# EAGLE design TPS22917 Breakout (EAGLE 9.5.2)
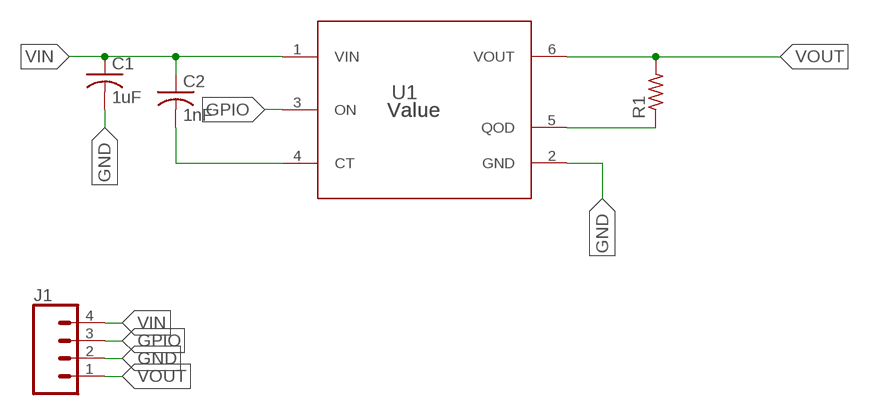
[diagram p0: schematic, sheet 1]

## Parts
C1  1uF  C-USC0603  [C0603]
C2  1nF  C-USC0603  [C0603]
J1  CONN_041X04_NO_SILK  [1X04_NO_SILK]
R1  R-US_R0603  [R0603]
U1  Value  TPS22917DBVRDBV0006_L  [DBV0006_L]

## Nets
GND: C1.2 J1.2 U1.2(GND)
GPIO: J1.3 U1.3(ON)
N$2: C2.2 U1.4(CT)
N$5: R1.1 U1.5(QOD)
VIN: C1.1 C2.1 J1.4 U1.1(VIN)
VOUT: J1.1 R1.2 U1.6(VOUT)

## Library data of the parts
C1 C2 = rcl:C-US: CAPACITOR, American symbol; SPICEPREFIX: C
J1 = SparkFun-Connectors:CONN_04: Multi connection point. Often used as Generic Header-pin footprint for 0.1 inch spaced/style header connections On any of the 0.1 inch spaced packages, you can populate with these: Break Away Headers - Straight <https://www.sparkfun.com/products/116> (PRT-00116) Break Away Male Headers - Right Angle <https://www.sparkfun.com/products/553> (PRT-00553) Female Headers <https://www.sparkfun.com/products/115> (PRT-00115) Break Away Headers - Machine Pin <https://www.sparkfun.com/products/117> (PRT-00117) Break Away Female Headers - Swiss Machine Pin <https://www.sparkfun.com/products/743> (PRT-00743) For SCREWTERMINALS and SPRING TERMINALS visit here: Screw Terimnals on SparkFun.com <https://www.sparkfun.com/search/results?term=Screw+Terminals> (5mm/3.5mm/2.54mm spacing) This device is also useful as a general connection point to wire up your design to another part of your project. Our various solder wires solder well into these plated through hole pads. Hook-Up Wire - Assortment (Stranded, 22 AWG) <https://www.sparkfun.com/products/11375> (PRT-11375) Hook-Up Wire - Assortment (Solid Core, 22 AWG) <https://www.sparkfun.com/products/11367> (PRT-11367) View the entire wire category on our website here <https://www.sparkfun.com/categories/141> Special notes: Molex polarized connector foot print use with SKU : PRT-08231 with associated crimp pins and housings. 1MM SMD Version SKU: PRT-10208; PROD_ID: CONN-09696
R1 = rcl:R-US_: RESISTOR, American symbol; SPICEPREFIX: R
U1 = TPS22917DBVR:TPS22917DBVR; MANUFACTURER: Texas Instruments; PARTNUMBER: TPS22917DBVR; REFDES: RefDes; TYPE: TYPE

## Board
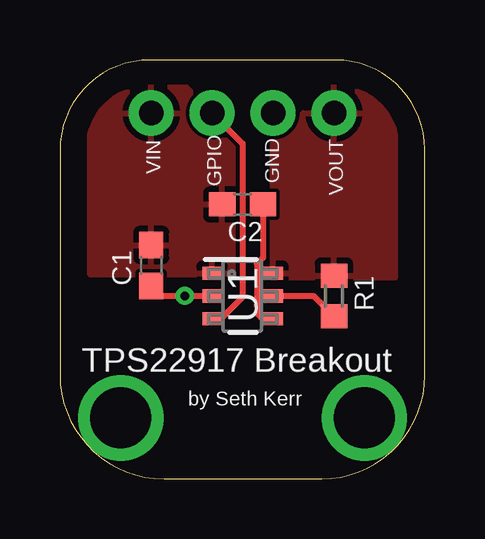
[diagram p1: board, top side]
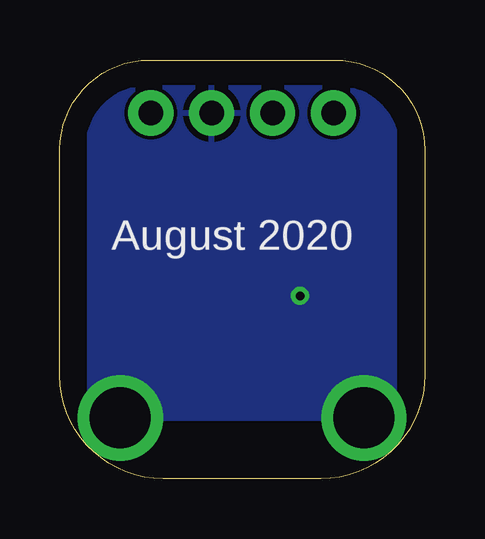
[diagram p2: board, bottom side, seen from below]

Size 15.22 x 17.45 mm. Coordinates in mm from the lower left corner, seen from the top.
Outline: 0,13.7 0,4.34 arc90 4.34,0 10.92,0 arc90 15.22,4.3 15.22,13.73 arc90 11.5,17.45 3.75,17.45 arc90 0,13.7
Copper layers (1*16): Top 0.035mm / dielectric 1.5mm / Bottom 0.035mm
Design rules "default *": minimum track width 6mil, minimum drill 0.35mm, track to track 6mil, track to pad 6mil, pad to pad 6mil, via to via 6mil, smd to smd 6mil, copper to edge 40mil, drill to drill 6mil, minimum pad ring 10mil, minimum via ring 8mil, stop-mask expansion 4mil, vias tented up to drill 30mil, thermal gap 10mil

### Footprints (pad centres in the part's own frame; a part is rotated, then mirrored left to right if it is on the bottom)
C0603 = smd 1.1 x 1: 1 -0.85,0; 2 0.85,0
1X04_NO_SILK = drill 1.016 pad 1.88: 1 0,0; 2 2.54,0; 3 5.08,0; 4 7.62,0
R0603 = smd 1 x 1.1: 1 -0.85,0; 2 0.85,0
DBV0006_L = smd 0.8 x 0.55: 1 -1.275,0.95; 2 -1.275,0; 3 -1.275,-0.95; 4 1.275,-0.95; 5 1.275,0; 6 1.275,0.95

### Placement (x,y rotation side)
C1  3.81,8.89 270 top
C2  7.62,11.43 0 top
J1  11.43,15.24 180 top
R1  11.43,7.62 90 top
U1  7.62,7.62 0 top

### Tracks (layer width: path | path; a pad name or v marks a point on that pad's centre or on a via)
GND  (via drill 0.35, 2.54)
  Top 0.254: C1.2 4.23,7.62 v5.21,7.62 U1.2
  other vias: 2.54,2.54 12.7,2.54
  pour Bottom: 1.27,16.51 13.97,16.51 13.97,2.54 1.27,2.54
GPIO
  Top 0.254: J1.3 7.62,13.97 7.62,7.57 6.79,6.74 6.72,6.67 U1.3
N$2
  Top 0.254: C2.2 8.47,9.21 8.22,8.96 8.22,7.23 8.26,7.19 8.26,6.86 8.44,6.67 U1.4
N$5
  Top 0.254: U1.5 10.58,7.62 R1.1
VIN
  pour Top: 1.27,16.51 5.08,16.51 7.62,13.97 7.62,8.51 1.27,8.51
VOUT
  Top 0.254: 11.33,8.57 R1.2
  pour Top: 8.89,8.38 8.89,13.97 11.43,16.51 13.97,16.51 13.97,8.38

### Text on the board
tNames: VIN | GPIO | GND | VOUT | TPS22917 Breakout | by Seth Kerr
bNames: August 2020